# Altium project PCB_Project1.PrjPCB
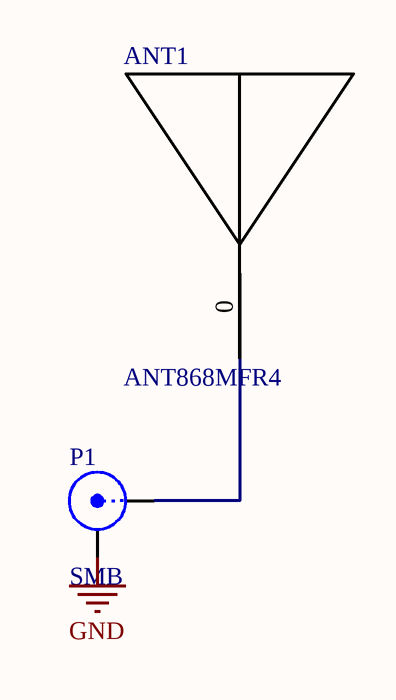
[diagram p0: Sheet1.SchDoc]
1 sheet, 2 parts. Net scope: global (net labels, ports and power ports of the same name join across sheets).
Board file: ANT868.PcbDoc

## Sheet Sheet1.SchDoc
size A4

### Parts
ANT1  ANT868MFR4  [ANT868MFR4]
P1  SMB  [SMB_V-RJ45]

### Nets
GND: P1.2(Y)
NetANT1_0: ANT1.0 P1.1(X)

### Library data of the parts
P1 = SMB: SMB Straight Connector; LatestRevisionDate: 17-Jul-2002; LatestRevisionNote: Re-released for DXP Platform.; Publisher: Altium Limited